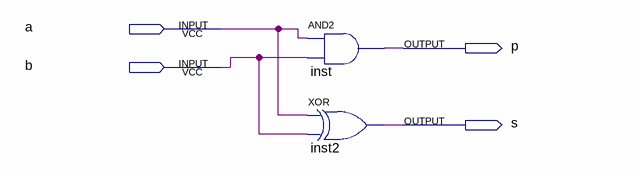
[diagram p0: schematic sheet]
// Quartus schematic s21_hs.bdf as structural Verilog: 2 symbols, 4 pins
module s21_hs (
  input  a,
  input  b,
  output p,
  output s
);

  and inst (p, a, b);
  xor inst2 (s, a, b);
endmodule
